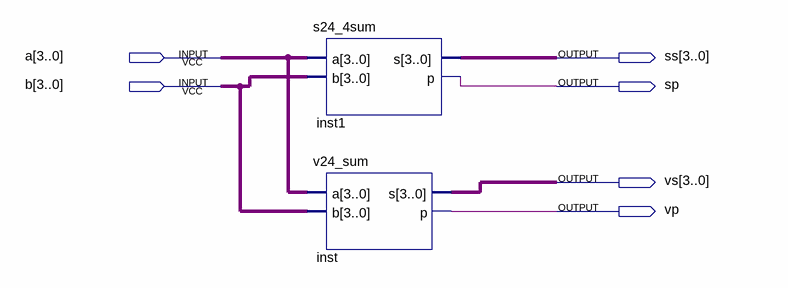
[diagram p0: schematic sheet]
// Quartus schematic sv24_sum.bdf as structural Verilog: 2 symbols, 6 pins
module sv24_sum (
  input  [3:0] a,
  input  [3:0] b,
  output [3:0] ss,
  output sp,
  output [3:0] vs,
  output vp
);

  s24_4sum inst1 (.a(a), .b(b), .s(ss), .p(sp));
  v24_sum inst (.a(a), .b(b), .s(vs), .p(vp));
endmodule
